# EAGLE design I2C-7-Segment-Backpack-dot56inch (EAGLE 9.5.2)
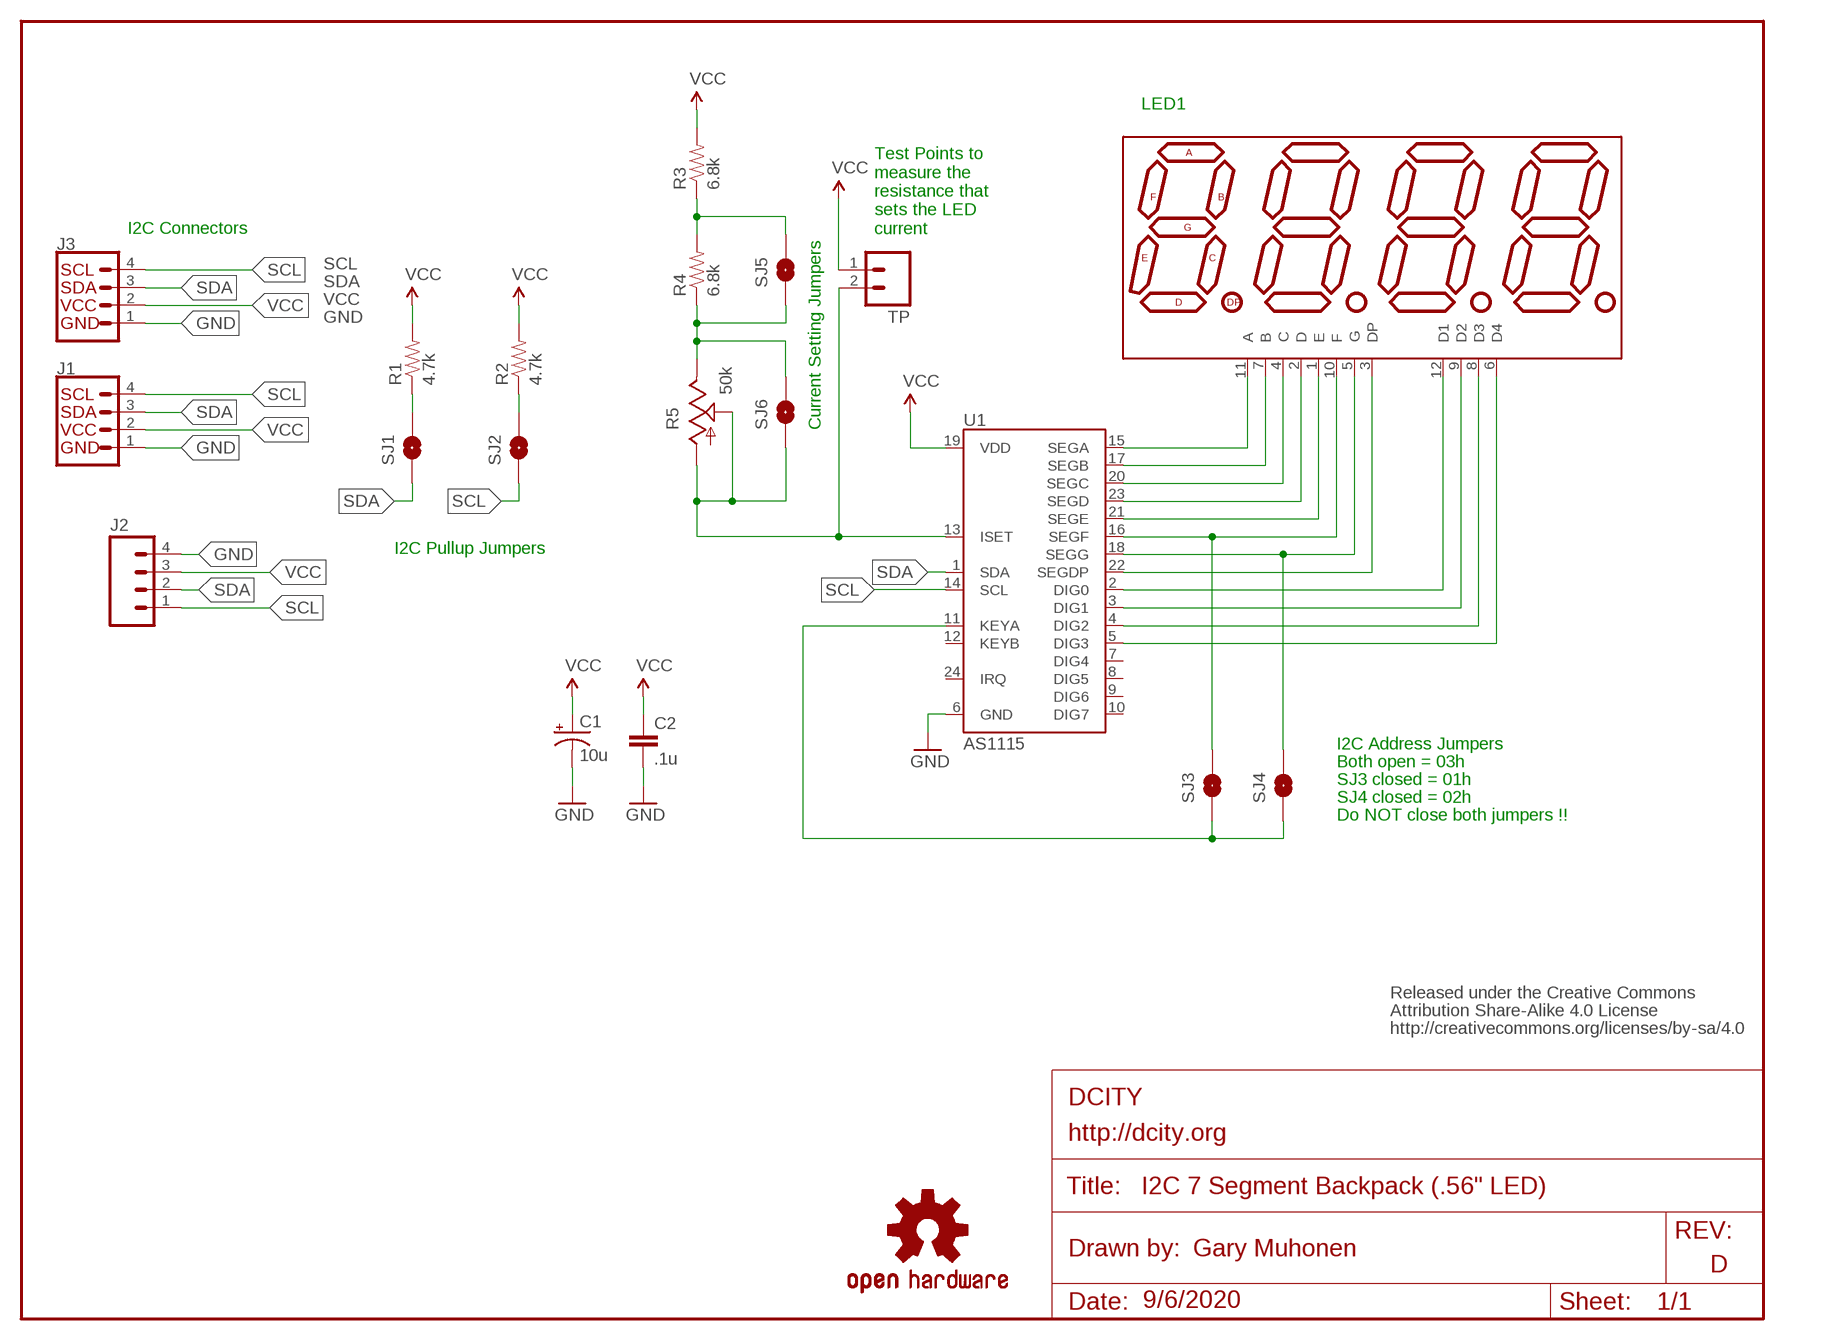
[diagram p0: schematic, sheet 1]
U$1 (DOCFIELD-WHT): COMPANYNAME: DCITY; COMPANYWEBSITE: http://dcity.org; DATE: 9/6/2020; DRAWNBY: Gary Muhonen; TITLE: I2C 7 Segment Backpack (.56" LED); VERSION: D

## Parts
C1  10u  CAP_POL0805  [0805-POL]
C2  .1u  CAP0805  [0805-CAP]
DISP1  LED1  7-SEGMENT-4DIGIT-COUNTER-PT6  [7-SEGMENT-4DIGIT-PT6]
J1  QWIIC_RIGHT_ANGLE  QWIIC_CONNECTORJS-1MM  [JST04_1MM_RA]
J2  M04LOCK  [1X04_LOCK]
J3  QWIIC_RIGHT_ANGLE  QWIIC_CONNECTORJS-1MM  [JST04_1MM_RA]
LOGO1  OSHW-LOGOS  [OSHW-LOGO-S]
R1  4.7k  RESISTOR0805  [0805-RES]
R2  4.7k  RESISTOR0805  [0805-RES]
R3  6.8k  RESISTOR0805  [0805-RES]
R4  6.8k  RESISTOR0805  [0805-RES]
R5  50k  POT-TC33X  [POT-TC33X]
SJ1  SOLDERJUMPERNO  [SJ_2S-NO]
SJ2  SOLDERJUMPERNO  [SJ_2S-NO]
SJ3  SOLDERJUMPERNO  [SJ_2S-NO]
SJ4  SOLDERJUMPERNO  [SJ_2S-NO]
SJ5  SOLDERJUMPERNO  [SJ_2S-NO]
SJ6  SOLDERJUMPERNO  [SJ_2S-NO]
TP  M02PTH  [1X02]
U1  AS1115  AS1115-LP  [TSSOP-24]
U$2  CREATIVE_COMMONS  [CREATIVE_COMMONS]

## Nets
GND: C1.- C2.2 J1.1 J2.4 J3.1 U1.6(GND)
N$1: DISP1.11(A) U1.15(SEGA)
N$2: DISP1.7(B) U1.17(SEGB)
N$3: DISP1.4(C) U1.20(SEGC)
N$4: DISP1.2(D) U1.23(SEGD)
N$5: DISP1.1(E) U1.21(SEGE)
N$6: DISP1.10(F) SJ3.2 U1.16(SEGF)
N$7: DISP1.5(G) SJ4.2 U1.18(SEGG)
N$8: DISP1.3(DP) U1.22(SEGDP)
N$9: DISP1.12(D1) U1.2(DIG0)
N$10: DISP1.9(D2) U1.3(DIG1)
N$11: DISP1.8(D3) U1.4(DIG2)
N$12: DISP1.6(D4) U1.5(DIG3)
N$13: SJ3.1 SJ4.1 U1.11(KEYA)
N$15: R3.1 R4.2 SJ5.2
N$16: R5.1(A) R5.2(S) SJ6.1 TP.2 U1.13(ISET)
N$18: R4.1 R5.3(E) SJ5.1 SJ6.2
N$20: R1.1 SJ1.2
N$21: R2.1 SJ2.2
SCL: J1.4 J2.1 J3.4 SJ2.1 U1.14(SCL)
SDA: J1.3 J2.2 J3.3 SJ1.1 U1.1(SDA)
VCC: C1.+ C2.1 J1.2 J2.3 J3.2 R1.2 R2.2 R3.2 TP.1 U1.19(VDD)
Unconnected: U1.7(DIG4) U1.8(DIG5) U1.9(DIG6) U1.10(DIG7) U1.12(KEYB) U1.24(IRQ)

## Notes on the sheet
- LED1
- I2C Connectors
- Test Points to
  measure the 
  resistance that
  sets the LED
  current
- Current Setting Jumpers
- I2C Pullup Jumpers
- I2C Address Jumpers
- Both open = 03h
- SJ3 closed = 01h
- SJ4 closed = 02h
- Do NOT close both jumpers !!

## Library data of the parts
C1 = 0:CAP_POL: Capacitor Polarized These are standard SMD and PTH capacitors. Normally 10uF, 47uF, and 100uF in electrolytic and tantalum varieties. Always verify the external diameter of the through hole cap, it varies with capacity, voltage, and manufacturer. The EIA devices should be standard.
C2 = 0:CAP: Capacitor Standard 0603 ceramic capacitor, and 0.1" leaded capacitor.
DISP1 = 0:7-SEGMENT-4DIGIT-COUNTER
J1 J3 = 0:QWIIC_CONNECTOR: SparkFun I2C Standard Qwiic Connector An SMD 1mm pitch JST connector makes it easy and quick (get it? Qwiic?) to connect I2C devices to each other. The Qwiic system <http://www.sparkfun.com/qwiic> enables fast and solderless connection between popular platforms and various sensors and actuators. We carry 200mm <https://www.sparkfun.com/products/14204>, 100mm <https://www.sparkfun.com/products/14205>, 50mm <https://www.sparkfun.com/products/14206>, and breadboard friendly <https://www.sparkfun.com/products/14207> Qwiic cables. We also offer 10 pcs strips <https://www.sparkfun.com/products/14323> the SMD connectors.; PROD_ID: CONN-13694
J2 = 0:M04: Header 4 Standard 4-pin 0.1" header. Use with straight break away headers (SKU : PRT-00116), right angle break away headers (PRT-00553), swiss pins (PRT-00743), machine pins (PRT-00117), and female headers (PRT-00115). Molex polarized connector foot print use with SKU : PRT-08231 with associated crimp pins and housings.
LOGO1 = 0:OSHW-LOGO: Open Source Hardware Logo This logo indicates the piece of hardware it is found on incorporates a OSHW license and/or adheres to the definition of open source hardware found here: http://freedomdefined.org/OSHW
R1-R4 = 0:RESISTOR: Resistor Basic schematic elements and footprints for 0603, 1206, and PTH 1/10th watt (small) resistors.
R5 = 0:POT
SJ1-SJ6 = 0:SOLDERJUMPER: Solder Jumper Standard SMD solder jumper. Used to automate production. Two varients : Normally Open and Normally Closed are the same, but have different paste layers. NC will have a large amount of paste and should jumper during reflow.
TP = 0:M02: Header 2 Standard 2-pin 0.1" header. Use with straight break away headers (SKU : PRT-00116), right angle break away headers (PRT-00553), swiss pins (PRT-00743), machine pins (PRT-00117), and female headers (PRT-00115). Molex polarized connector foot print use with SKU : PRT-08233 with associated crimp pins and housings.
U1 = 0:AS1115: 8 Digit 7 segment LED Driver Packages: TSSOP-24, 24-pin QFN
U$2 = 0:CREATIVE_COMMONS

## Board
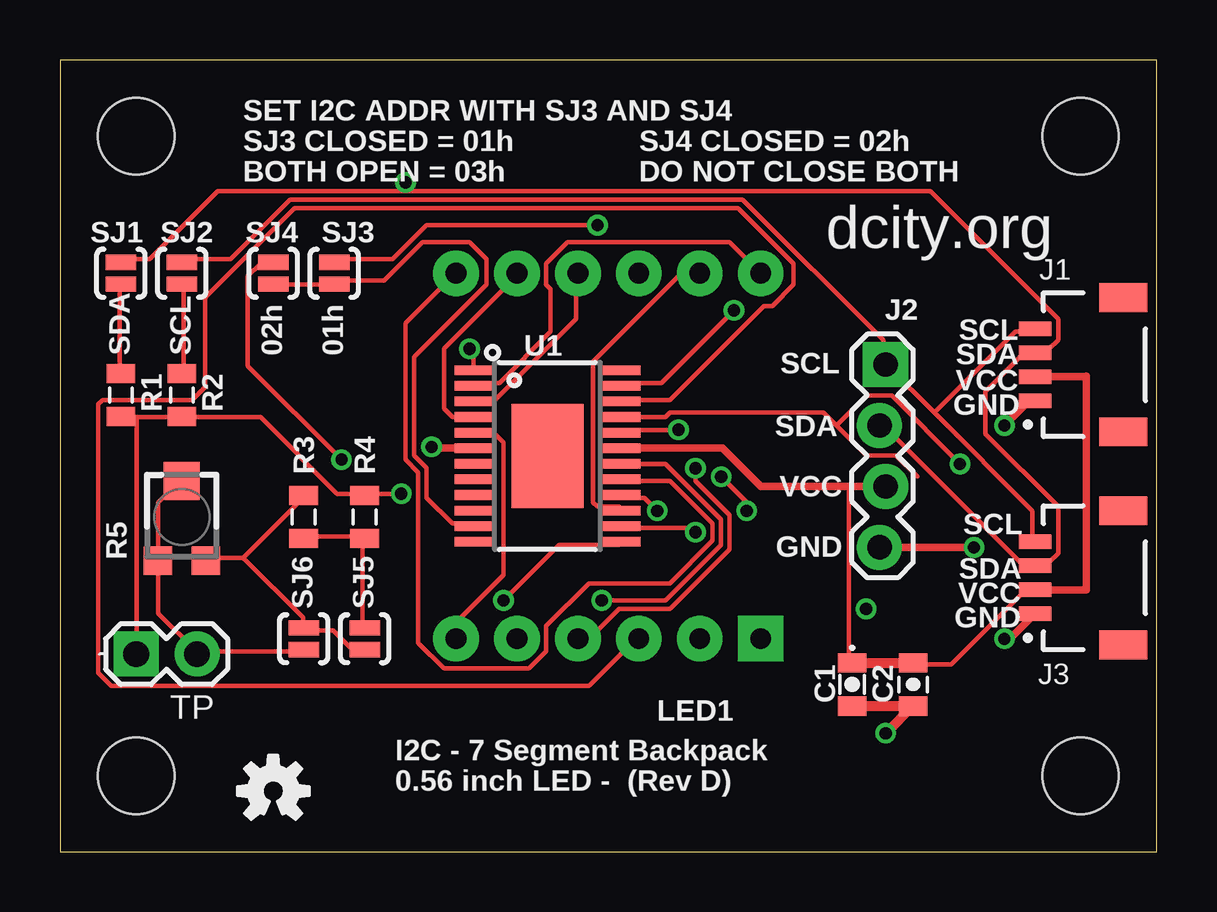
[diagram p1: board, top side]
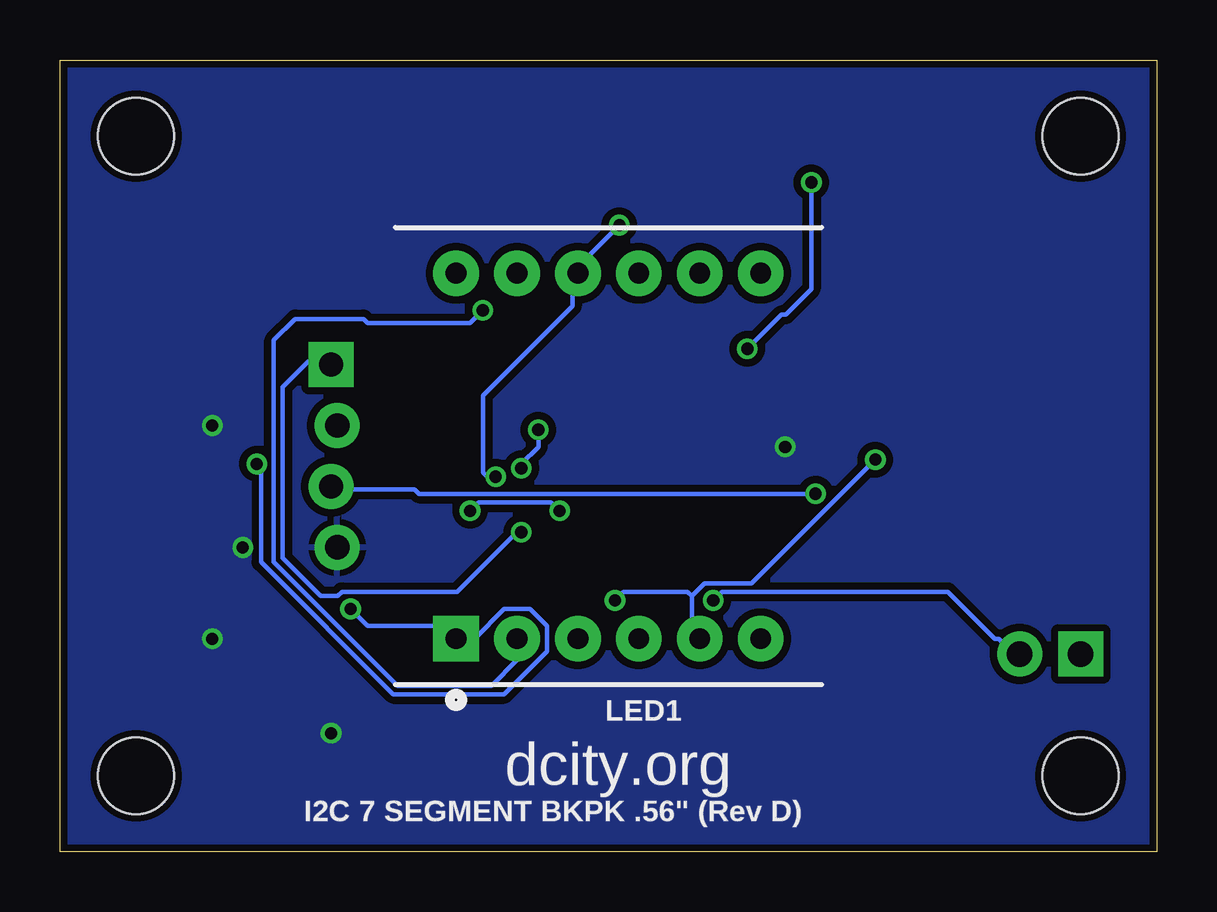
[diagram p2: board, bottom side, seen from below]

Size 45.72 x 33.02 mm. Coordinates in mm from the lower left corner, seen from the top.
Outline: 0,0 45.72,0 45.72,33.02 0,33.02 0,0
Copper layers (1*16): Top 0.035mm / dielectric 1.5mm / Bottom 0.035mm
Design rules "7mils-gary *": minimum track width 7mil, minimum drill 20mil, track to track 7mil, track to pad 7mil, pad to pad 7mil, via to via 7mil, smd to smd 7mil, copper to edge 7mil, drill to drill 7mil, minimum pad ring 7mil, minimum via ring 7mil, stop-mask expansion 4mil, vias tented up to drill 25mil, thermal gap 10mil
Holes 3.17 mm at 3.17,29.84 42.55,29.84 42.55,3.17 3.17,3.17
vRestrict: area 1.1,25.3 to 3.6,26.4; area 4.1,25.4 to 6.5,26.4; area 7.4,25.3 to 9.8,26.4; area 10.5,25.4 to 13,26.4; area 1.9,20.7 to 3,23; area 4.6,20.7 to 5.6,23; area 8.4,20.6 to 9.4,23; area 10.9,20.7 to 11.9,23; area 3.3,18.2 to 4.3,19.8; area 5.8,18.2 to 6.9,19.9; area 9.4,15.6 to 10.8,17.4; area 12.2,15.6 to 13.3,17.4; 15 more areas

### Footprints (pad centres in the part's own frame; a part is rotated, then mirrored left to right if it is on the bottom)
0805-POL = smd 0.8 x 1.2: + 0.9,0; - -0.9,0
0805-CAP = smd 0.8 x 1.2: 1 -0.9,0; 2 0.9,0
7-SEGMENT-4DIGIT-PT6 = drill 0.864 pad 1.905 square: 1 -6.35,-3.81 | drill 0.864 pad 1.905: 2 -3.81,-3.81; 3 -1.27,-3.81; 4 1.27,-3.81; 5 3.81,-3.81; 6 6.35,-3.81; 7 6.35,11.43; 8 3.81,11.43; 9 1.27,11.43; 10 -1.27,11.43; 11 -3.81,11.43; 12 -6.35,11.43
JST04_1MM_RA = smd 0.6 x 1.35: 1 -1.5,0; 2 -0.5,0; 3 0.5,0; 4 1.5,0 | smd 1.2 x 2: NC1 2.8,-3.675; NC2 -2.8,-3.675
1X04_LOCK = drill 1.016 pad 1.88 square: 1 0,0.127 | drill 1.016 pad 1.88: 2 2.54,-0.127; 3 5.08,0.127; 4 7.62,-0.127
0805-RES = smd 0.8 x 1.2: 1 -0.9,0; 2 0.9,0
POT-TC33X = smd 1.2 x 1.2: 1 -1,-1.825; 3 1,-1.825 | smd 1.5 x 1.6: 2 0,1.5
SJ_2S-NO = smd 0.635 x 1.27: 1 -0.45,0; 2 0.45,0
1X02 = drill 1.067 pad 1.88 square: 1 0,0 | drill 1.067 pad 1.88: 2 2.54,0
TSSOP-24 = smd 0.4 x 1.65: 1 -3.575,-3.05; 2 -2.925,-3.05; 3 -2.275,-3.05; 4 -1.625,-3.05; 5 -0.975,-3.05; 6 -0.325,-3.05; 7 0.325,-3.05; 8 0.975,-3.05; 9 1.625,-3.05; 10 2.275,-3.05; 11 2.925,-3.05; 12 3.575,-3.05; 13 3.575,3.05; 14 2.925,3.05; 15 2.275,3.05; 16 1.625,3.05; 17 0.975,3.05; 18 0.325,3.05; 19 -0.325,3.05; 20 -0.975,3.05; 21 -1.625,3.05; 22 -2.275,3.05; 23 -2.925,3.05; 24 -3.575,3.05 | smd 4.32 x 3: EP 0,0

### Placement (x,y rotation side)
C1  33.02,6.99 90 top
C2  35.56,6.99 270 top
DISP1  22.86,12.7 0 bottom
J1  40.64,20.32 90 top
J2  34.29,20.32 270 top
J3  40.64,11.43 90 top
LOGO1  8.89,2.54 0 top
R1  2.54,19.05 270 top
R2  5.08,19.05 270 top
R3  12.7,13.97 90 top
R4  10.16,13.97 270 top
R5  5.08,13.97 0 top
SJ1  2.54,24.13 270 top
SJ2  5.08,24.13 270 top
SJ3  11.43,24.13 90 top
SJ4  8.89,24.13 90 top
SJ5  12.7,8.89 90 top
SJ6  10.16,8.89 90 top
TP  3.17,8.26 0 top
U1  20.32,16.51 270 top
U$2  1.27,34.29 0 top

### Tracks (layer width: path | path; a pad name or v marks a point on that pad's centre or on a via)
GND  (via drill 0.51)
  Top 0.305: U1.6 15.55,16.84 | J1.1 40.41,18.82 v39.37,17.78 | J3.1 39.6,8.89 v39.37,8.89 | J2.4 v38.1,12.7
  Top 0.406: C1.- C2.2 35.55,6.08 v34.42,4.95 | 15.55,16.84 v15.49,16.89
  pour Bottom (isolate 0.305): 0,33.02 45.72,33.02 45.72,0 0,0
N$1
  Top 0.178: U1.15 23.29,14.4 22.4,14.4 22.23,14.58 22.23,20.45 25.78,24 26.67,24 DISP1.11
N$2
  Top 0.178: U1.17 23.47,15.47 25.43,15.47 27.2,13.69 27.2,12.98 25.43,11.2 22.05,11.2 20.27,9.42 20.27,8.36 19.56,7.64 16,7.64 14.94,8.71 14.94,15.82 14.4,16.36 14.4,22.05 16.36,24 DISP1.7
N$3  (via drill 0.51)
  Top 0.178: v26.49,16 26.49,15.47 27.91,14.05 27.91,12.62 25.43,10.13 23.29,10.13 22.05,8.89 DISP1.4 | v25.78,17.6 23.47,17.6 U1.20
  Bottom 0.178: v25.78,17.6 25.78,16.89 26.49,16.18 v26.49,16
N$4  (via drill 0.51)
  Top 0.178: v28.09,22.58 25.07,19.56 23.47,19.56 U1.23
  Bottom 0.178: v28.09,22.58 28.63,22.05 32.89,22.05 33.07,22.23 35.92,22.23 36.8,21.34 36.8,12.09 31.65,6.93 27.74,6.93 26.67,8 DISP1.2
N$5  (via drill 0.51)
  Top 0.178: 29.34,8.89 DISP1.1 | 32.36,17.78 33.6,16.54 34.85,16.54 35.74,15.65 | 32.36,17.78 31.83,18.31 25.43,18.31 25.25,18.14 23.47,18.14 U1.21 | v37.52,16.18 34.67,19.02 33.6,19.02 32.36,17.78
  Bottom 0.178: v33.6,10.13 32.89,9.42 29.87,9.42 29.34,8.89 DISP1.1 28.45,8.89 27.2,10.13 26.14,10.13 25.43,9.42 25.43,8.36 27.2,6.58 31.83,6.58 37.34,12.09 37.34,16 v37.52,16.18
N$6  (via drill 0.51)
  Top 0.178: v24.89,14.22 24.36,14.76 23.47,14.76 U1.16 | v22.4,26.14 15.29,26.14 13.87,24.71 11.56,24.71 SJ3.2 | v28.63,14.22 28.63,14.58 v27.56,15.65
  Bottom 0.178: v22.4,26.14 24,24.54 24,24.18 DISP1.10 24.18,24 24.36,23.82 24.36,22.76 28.09,19.02 28.09,15.82 27.74,15.47 v27.56,15.65 | v24.89,14.22 25.25,14.58 28.27,14.58 v28.63,14.22
N$7  (via drill 0.51)
  Top 0.178: v11.73,16.36 7.82,20.27 7.82,24 8.36,24.54 8.89,24.54 SJ4.2 | v22.58,10.49 25.25,10.49 27.56,12.8 27.56,13.87 25.25,16.18 23.47,16.18 U1.18
  Bottom 0.178: v11.73,16.36 16.89,11.2 18.85,11.2 19.38,10.67 | 19.38,10.67 19.38,9.07 19.2,8.89 DISP1.5 | v22.58,10.49 22.23,10.85 19.56,10.85 19.38,10.67
N$8
  Top 0.178: 24.18,8.89 DISP1.3 24,8.89 22.05,6.93 2.13,6.93 1.6,7.47 1.6,18.67 1.78,18.85 5.51,18.85 6.04,19.38 6.04,23.11 9.78,26.85 28.27,26.85 30.58,24.54 30.58,23.65 29.69,22.76 29.34,22.76 25.43,18.85 23.47,18.85 U1.22
N$9
  Top 0.178: DISP1.12 27.91,25.43 21.16,25.43 20.27,24.54 20.27,23.65 20.45,23.47 20.45,21.69 18.31,19.56 17.42,19.56 U1.2
N$10
  Top 0.178: U1.3 17.42,18.85 18.14,18.85 21.51,22.23 21.51,24 DISP1.9
N$11
  Top 0.178: U1.4 17.25,18.14 16.36,18.14 16,18.49 16,20.98 19.02,24 DISP1.8
N$12
  Top 0.178: U1.5 17.42,17.42 18.14,17.42 18.49,17.07 18.49,11.56 16.54,9.6 16.54,8.89 DISP1.6
N$13
  Top 0.178: SJ4.1 8.89,23.65 11.38,23.65 SJ3.1 11.56,23.82 13.51,23.82 15.11,25.43 17.07,25.43 17.78,24.71 17.78,23.65 14.76,20.62 14.76,16.54 15.29,16 15.29,14.76 16.36,13.69 17.25,13.69 U1.11
N$15
  Top 0.178: R4.2 10.31,13.16 12.62,13.16 R3.1 12.62,12.98 12.62,9.42 SJ5.2
N$16  (via drill 0.51)
  Top 0.178: R5.2 4.98,15.47 4.09,14.58 4.09,12.27 R5.1 4.09,12.09 4.09,9.96 5.69,8.36 TP.2 5.87,8.36 10.13,8.36 SJ6.1 | v18.49,10.49 20.8,12.8 23.29,12.8 U1.13
  Bottom 0.178: v18.49,10.49 18.14,10.85 8.71,10.85 6.76,8.89 6.58,8.89 5.87,8.18 TP.2
N$18
  Top 0.178: SJ5.1 12.62,8.53 12.09,8.53 11.38,9.25 10.31,9.25 SJ6.2 10.13,9.42 10.13,9.78 7.64,12.27 | 7.64,12.27 6.22,12.27 R5.3 | 7.64,12.27 10.13,14.76 R4.1
N$20
  Top 0.178: R1.1 2.49,20.09 2.49,23.65 SJ1.2
N$21
  Top 0.178: R2.1 5.16,20.09 5.16,23.65 SJ2.2
SCL  (via drill 0.51)
  Top 0.178: v26.49,13.34 26.31,13.51 23.47,13.51 U1.14 | SJ2.1 5.16,24.71 7.11,24.71 9.6,27.2 28.45,27.2 34.31,21.34 34.31,20.45 J2.1 34.49,20.27 36.45,18.31 | 36.45,18.31 40.54,14.22 40.54,12.98 J3.4 | 36.45,18.31 39.83,21.69 40.54,21.69 J1.4
  Bottom 0.178: v26.49,13.34 26.67,13.34 29.16,10.85 33.96,10.85 34.14,10.67 34.85,10.67 36.45,12.27 36.45,19.38 35.38,20.45 34.49,20.45 J2.1
SDA  (via drill 0.51)
  Top 0.178: 17.42,20.09 U1.1 17.25,20.09 17.25,20.8 v17.07,20.98 | 33.98,17.6 J2.2 34.31,17.78 40.01,12.09 40.54,12.09 J3.3 40.72,12.09 41.25,12.09 41.6,12.45 41.6,14.4 38.58,17.42 38.58,19.2 40.18,20.8 40.54,20.8 J1.3 40.72,20.98 41.25,20.98 41.6,21.34 41.6,22.23 36.27,27.56 14.4,27.56 | 14.4,27.56 6.58,27.56 3.73,24.71 2.67,24.71 SJ1.1 | 14.4,27.56 v14.4,27.91
  Bottom 0.178: v17.07,20.98 15.65,22.4 15.47,22.4 14.4,23.47 v14.4,27.91
VCC  (via drill 0.51)
  Top 0.178: 3.2,18.14 4.98,18.14 R2.2 5.16,18.14 8.36,18.14 11.56,14.94 12.62,14.94 R3.2 12.8,14.94 v14.22,14.94 | 3.2,18.14 2.67,18.14 R1.2 | 3.2,18.14 3.2,8.36 TP.1 | C2.1 35.74,7.82 37.16,7.82 40.18,10.85 40.54,10.85 J3.2 | 32.89,15.24 32.89,8 C1.+
  Top 0.305: U1.19 27.61,16.84 29.21,15.24 32.89,15.24 J2.3 | J1.2 42.76,19.82 42.77,19.84 42.77,10.94 42.77,10.93 | J3.2 42.77,10.93 | 42.77,10.93 42.77,10.92
  Top 0.406: C1.+ C2.1 35.57,7.87 | 34.69,15.51 J2.3
  Bottom 0.178: v14.22,14.94 30.76,14.94 30.94,15.11 34.37,15.11 J2.3

### Text on the board
tPlace: SET I2C ADDR WITH SJ3 AND SJ4 | SJ3 CLOSED = 01h | SJ4 CLOSED = 02h | BOTH OPEN = 03h | DO NOT CLOSE BOTH | dcity.org | SCL | SDA | SCL | 02h | 01h | SCL | SDA | VCC | GND | SDA | VCC | SCL | GND | SDA | VCC | GND | LED1 | I2C - 7 Segment Backpack | 0.56 inch LED - (Rev D)
bPlace: LED1 | dcity.org | I2C 7 SEGMENT BKPK .56" (Rev D)